# EAGLE design pe_09_version1_3 (EAGLE 9.5.1)
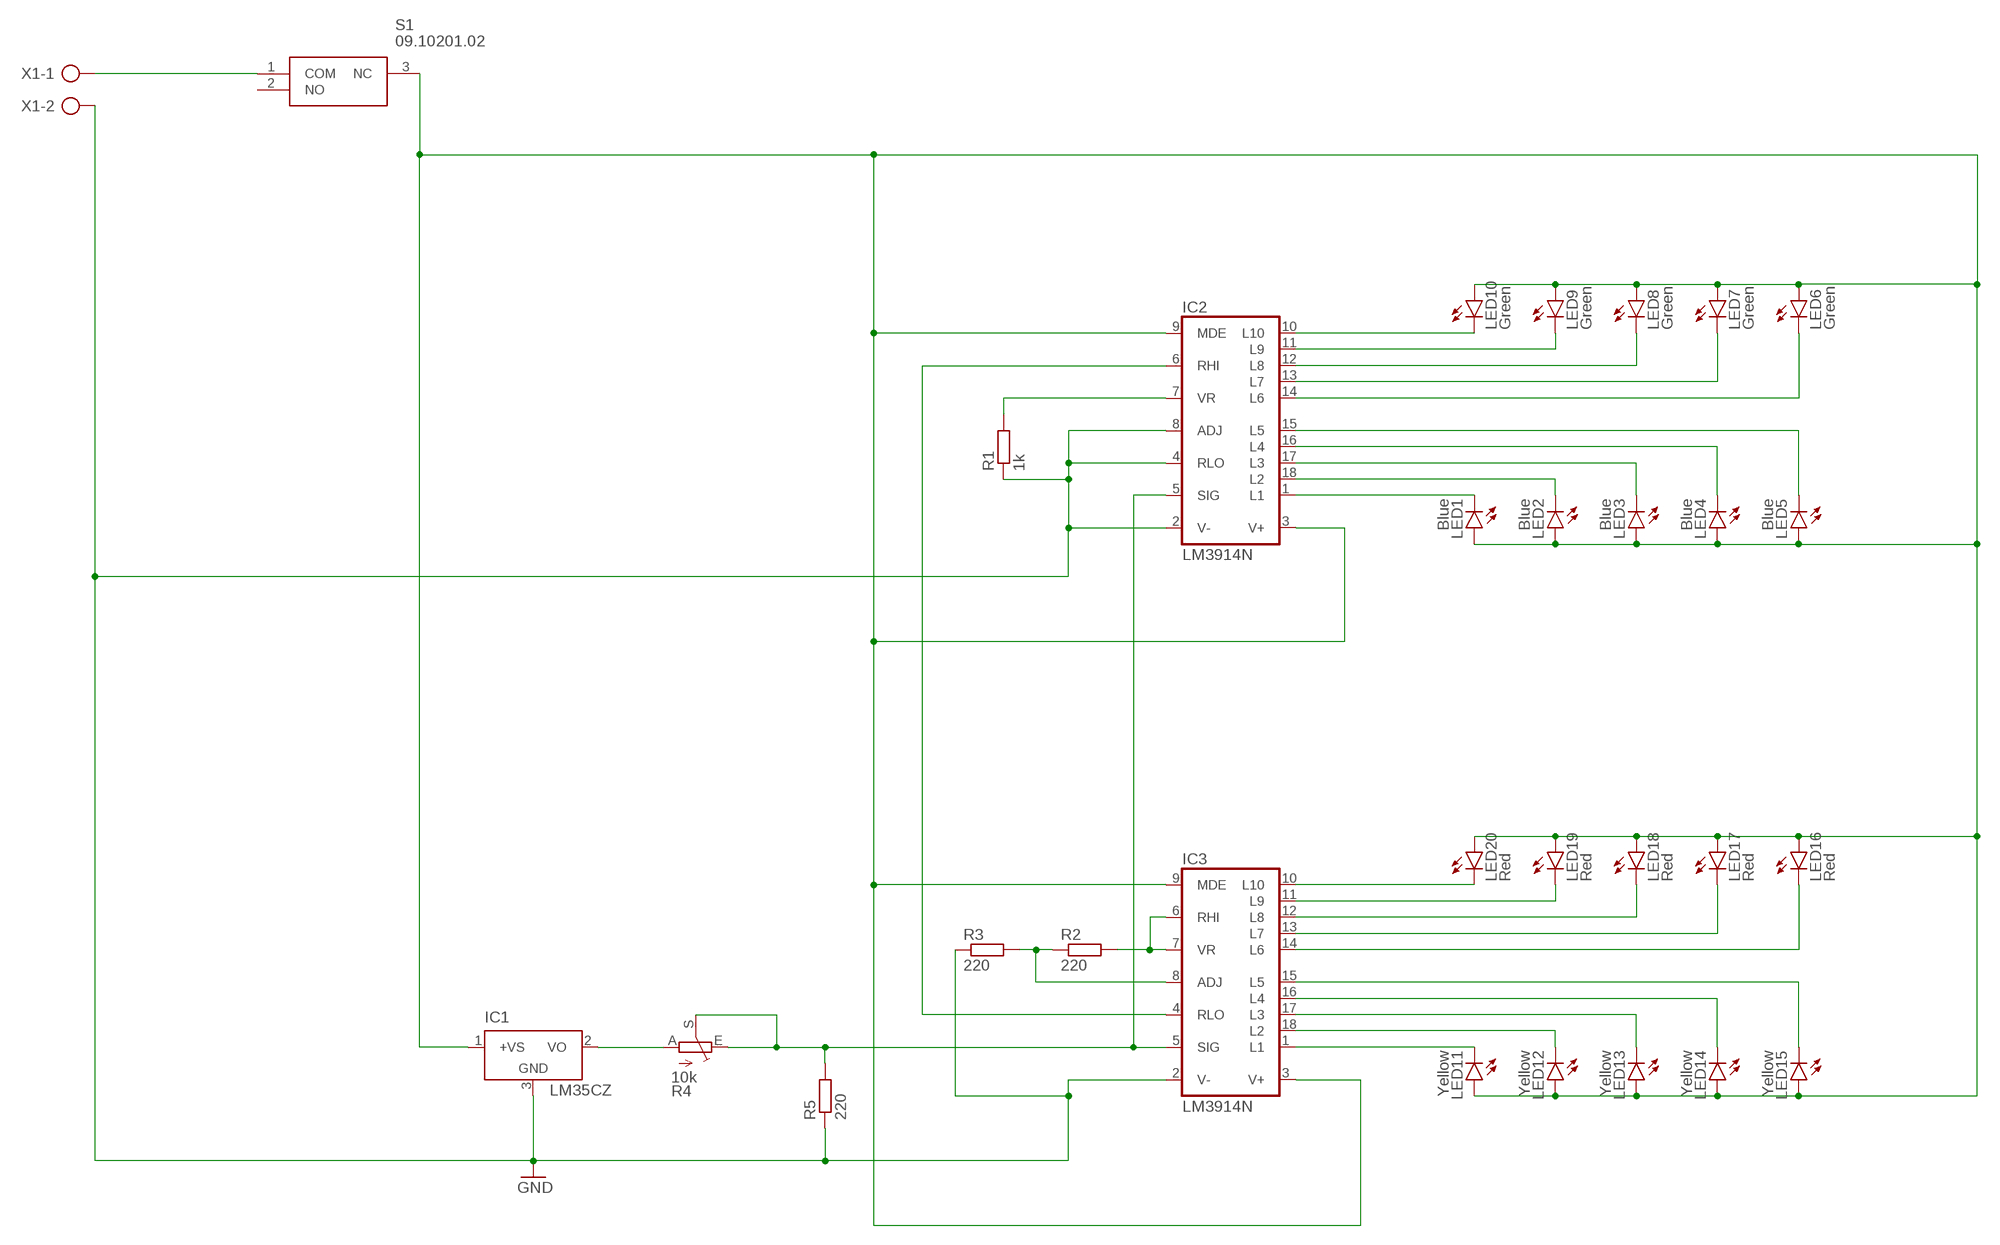
[diagram p0: schematic, sheet 1]

## Parts
IC1  LM35CZ  [TO92]
IC2  LM3914N  [DIL18]
IC3  LM3914N  [DIL18]
LED1  Blue  LED5MM  [LED5MM]
LED2  Blue  LED5MM  [LED5MM]
LED3  Blue  LED5MM  [LED5MM]
LED4  Blue  LED5MM  [LED5MM]
LED5  Blue  LED5MM  [LED5MM]
LED6  Green  LED5MM  [LED5MM]
LED7  Green  LED5MM  [LED5MM]
LED8  Green  LED5MM  [LED5MM]
LED9  Green  LED5MM  [LED5MM]
LED10  Green  LED5MM  [LED5MM]
LED11  Yellow  LED5MM  [LED5MM]
LED12  Yellow  LED5MM  [LED5MM]
LED13  Yellow  LED5MM  [LED5MM]
LED14  Yellow  LED5MM  [LED5MM]
LED15  Yellow  LED5MM  [LED5MM]
LED16  Red  LED5MM  [LED5MM]
LED17  Red  LED5MM  [LED5MM]
LED18  Red  LED5MM  [LED5MM]
LED19  Red  LED5MM  [LED5MM]
LED20  Red  LED5MM  [LED5MM]
R1  1k  R-EU_0207/10  [0207/10]
R2  220  R-EU_0207/10  [0207/10]
R3  220  R-EU_0207/10  [0207/10]
R4  10k  TRIM_EU-PT10  [PT-10]
R5  220  R-EU_0207/10  [0207/10]
S1  09.10201.02  [091020102]
X1  AK500/2  [AK500/2]

## Nets
GND: IC1.3(GND) IC2.2(V-) IC2.4(RLO) IC2.8(ADJ) IC3.2(V-) R1.1 R3.1 R5.1 X1.2
N$1: IC2.1(L1) LED1.K(C)
N$2: IC2.18(L2) LED2.K(C)
N$3: IC2.17(L3) LED3.K(C)
N$4: IC2.16(L4) LED4.K(C)
N$5: IC2.15(L5) LED5.K(C)
N$6: IC2.10(L10) LED10.K(C)
N$7: IC2.11(L9) LED9.K(C)
N$8: IC2.12(L8) LED8.K(C)
N$9: IC2.13(L7) LED7.K(C)
N$10: IC2.14(L6) LED6.K(C)
N$11: S1.1(COM) X1.1
N$12: IC2.7(VR) R1.2
N$13: IC3.1(L1) LED11.K(C)
N$14: IC3.18(L2) LED12.K(C)
N$15: IC3.17(L3) LED13.K(C)
N$16: IC3.16(L4) LED14.K(C)
N$17: IC3.15(L5) LED15.K(C)
N$18: IC3.10(L10) LED20.K(C)
N$19: IC3.11(L9) LED19.K(C)
N$20: IC3.12(L8) LED18.K(C)
N$21: IC3.13(L7) LED17.K(C)
N$22: IC3.14(L6) LED16.K(C)
N$23: IC2.6(RHI) IC3.4(RLO)
N$24: IC3.6(RHI) IC3.7(VR) R2.2
N$25: IC3.8(ADJ) R2.1 R3.2
N$26: IC1.2(VO) R4.A
N$27: IC2.5(SIG) IC3.5(SIG) R4.E R4.S R5.2
V+: IC1.1(+VS) IC2.3(V+) IC2.9(MDE) IC3.3(V+) IC3.9(MDE) LED1.A LED2.A LED3.A LED4.A LED5.A LED6.A LED7.A LED8.A LED9.A LED10.A LED11.A LED12.A LED13.A LED14.A LED15.A LED16.A LED17.A LED18.A LED19.A LED20.A S1.3(NC)
Unconnected: S1.2(NO)

## Library data of the parts
IC1 = lm35:LM35: Single-Supply Centigrade Temperature Sensor Vout = (10mV/°C x Temp °C) +5mmmV Source: http://www.national.com/ds/LM/LM35.pdf
IC2 IC3 = linear:LM3914N: LED DRIVER senses analog voltage levels and drives 10 LEDs
LED1-LED20 = led:LED: LED OSRAM: - CHIPLED LG R971, LG N971, LY N971, LG Q971, LY Q971, LO R971, LY R971 LH N974, LH R974 LS Q976, LO Q976, LY Q976 LO Q996 - Hyper CHIPLED LW Q18S LB Q993, LB Q99A, LB R99A - SideLED LS A670, LO A670, LY A670, LG A670, LP A670 LB A673, LV A673, LT A673, LW A673 LH A674 LY A675 LS A676, LA A676, LO A676, LY A676, LW A676 LS A679, LY A679, LG A679 - Hyper Micro SIDELED® LS Y876, LA Y876, LO Y876, LY Y876 LT Y87S - SmartLED LW L88C, LW L88S LB L89C, LB L89S, LG L890 LS L89K, LO L89K, LY L89K LS L896, LA L896, LO L896, LY L896 - TOPLED LS T670, LO T670, LY T670, LG T670, LP T670 LSG T670, LSP T670, LSY T670, LOP T670, LYG T670 LG T671, LOG T671, LSG T671 LB T673, LV T673, LT T673, LW T673 LH T674 LS T676, LA T676, LO T676, LY T676, LB T676, LH T676, LSB T676, LW T676 LB T67C, LV T67C, LT T67C, LS T67K, LO T67K, LY T67K, LW E67C LS E67B, LA E67B, LO E67B, LY E67B, LB E67C, LV E67C, LT E67C LW T67C LS T679, LY T679, LG T679 LS T770, LO T770, LY T770, LG T770, LP T770 LB T773, LV T773, LT T773, LW T773 LH T774 LS E675, LA E675, LY E675, LS T675 LS T776, LA T776, LO T776, LY T776, LB T776 LHGB T686 LT T68C, LB T68C - Hyper Mini TOPLED® LB M676 - Mini TOPLED Santana® LG M470 LS M47K, LO M47K, LY M47K Source: http://www.osram.convergy.de LUXEON: - LUMILED® LXK2-PW12-R00, LXK2-PW12-S00, LXK2-PW14-U00, LXK2-PW14-V00 LXK2-PM12-R00, LXK2-PM12-S00, LXK2-PM14-U00 LXK2-PE12-Q00, LXK2-PE12-R00, LXK2-PE12-S00, LXK2-PE14-T00, LXK2-PE14-U00 LXK2-PB12-K00, LXK2-PB12-L00, LXK2-PB12-M00, LXK2-PB14-N00, LXK2-PB14-P00, LXK2-PB14-Q00 LXK2-PR12-L00, LXK2-PR12-M00, LXK2-PR14-Q00, LXK2-PR14-R00 LXK2-PD12-Q00, LXK2-PD12-R00, LXK2-PD12-S00 LXK2-PH12-R00, LXK2-PH12-S00 LXK2-PL12-P00, LXK2-PL12-Q00, LXK2-PL12-R00 Source: www.luxeon.com KINGBRIGHT: KA-3528ASYC Source: www.kingbright.com
R1-R3 R5 = resistor:R-EU_: RESISTOR, European symbol
R4 = pot:TRIM_EU-: POTENTIOMETER
S1 = SamacSys_Parts:09.10201.02: Slide Switches 1K2 ACT GOLD RIGHT ANGL MNT RED Source: Datasheet <https://componentsearchengine.com/Datasheets/1/09.10201.02.pdf>; ALLIED_NUMBER: 70293429; ALLIED_PRICE-STOCK: https://www.alliedelec.com/eao-09-10201-02/70293429/; DESCRIPTION: Slide Switches 1K2 ACT GOLD RIGHT ANGL MNT RED; HEIGHT: 2.5mm; MANUFACTURER_NAME: EAO; MANUFACTURER_PART_NUMBER: 09.10201.02; MOUSER_PART_NUMBER: 123-09.10201.02; MOUSER_PRICE-STOCK: https://www.mouser.com/Search/Refine.aspx?Keyword=123-09.10201.02
X1 = con-ptr500:AK500/2: CONNECTOR; OC_FARNELL: unknown; OC_NEWARK: unknown

## Net classes
0 default: width 0.8 mm, clearance 0.205 mm

## Board
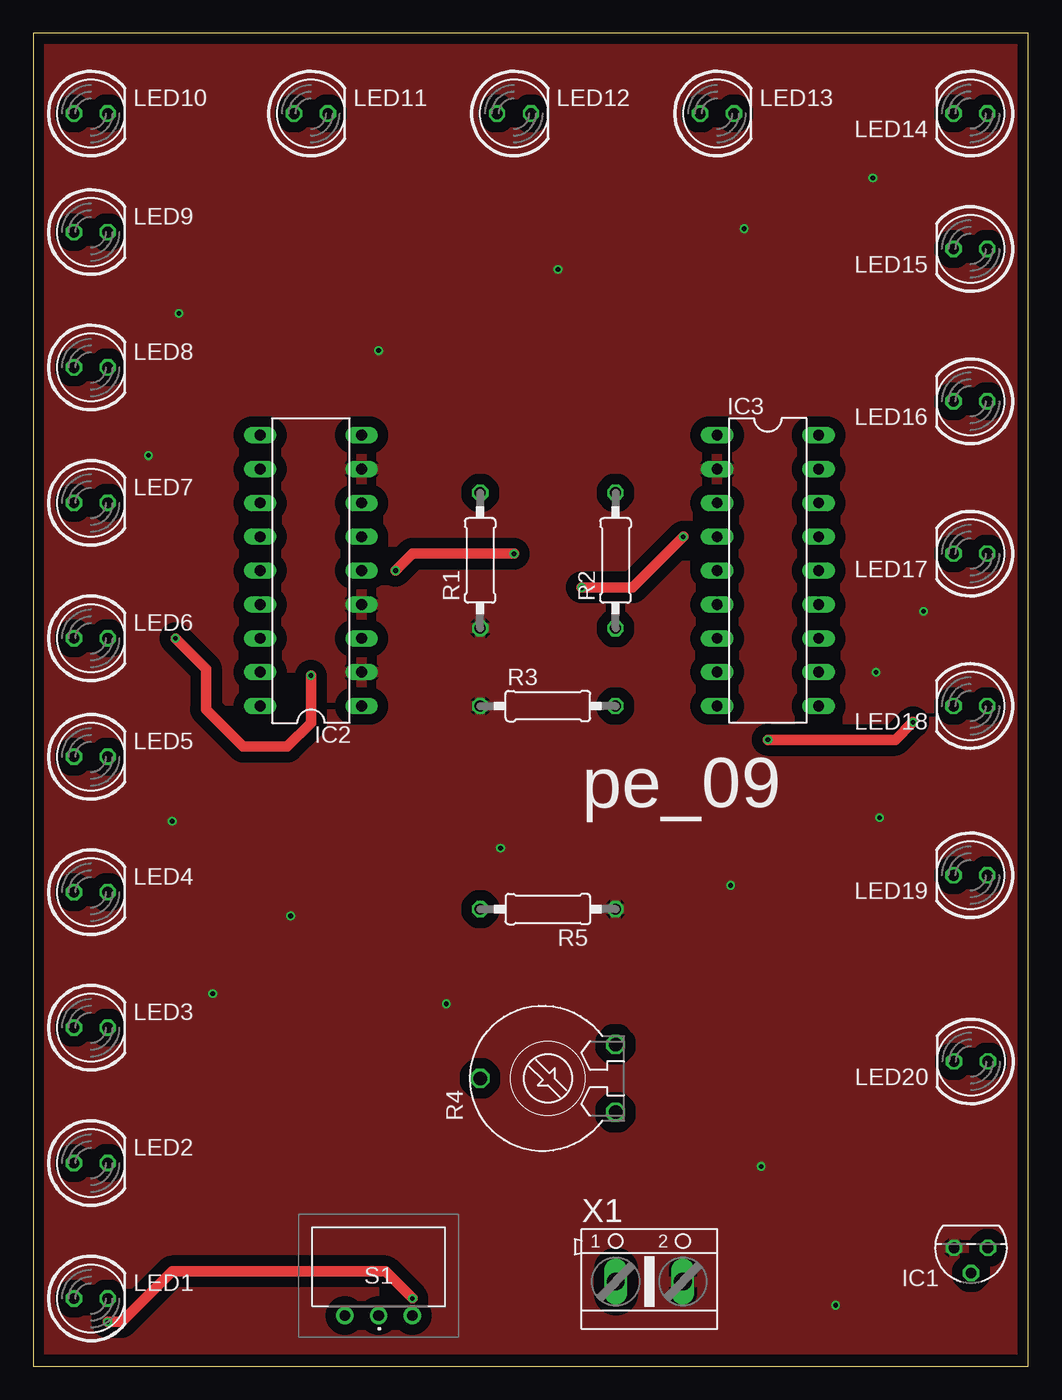
[diagram p1: board, top side]
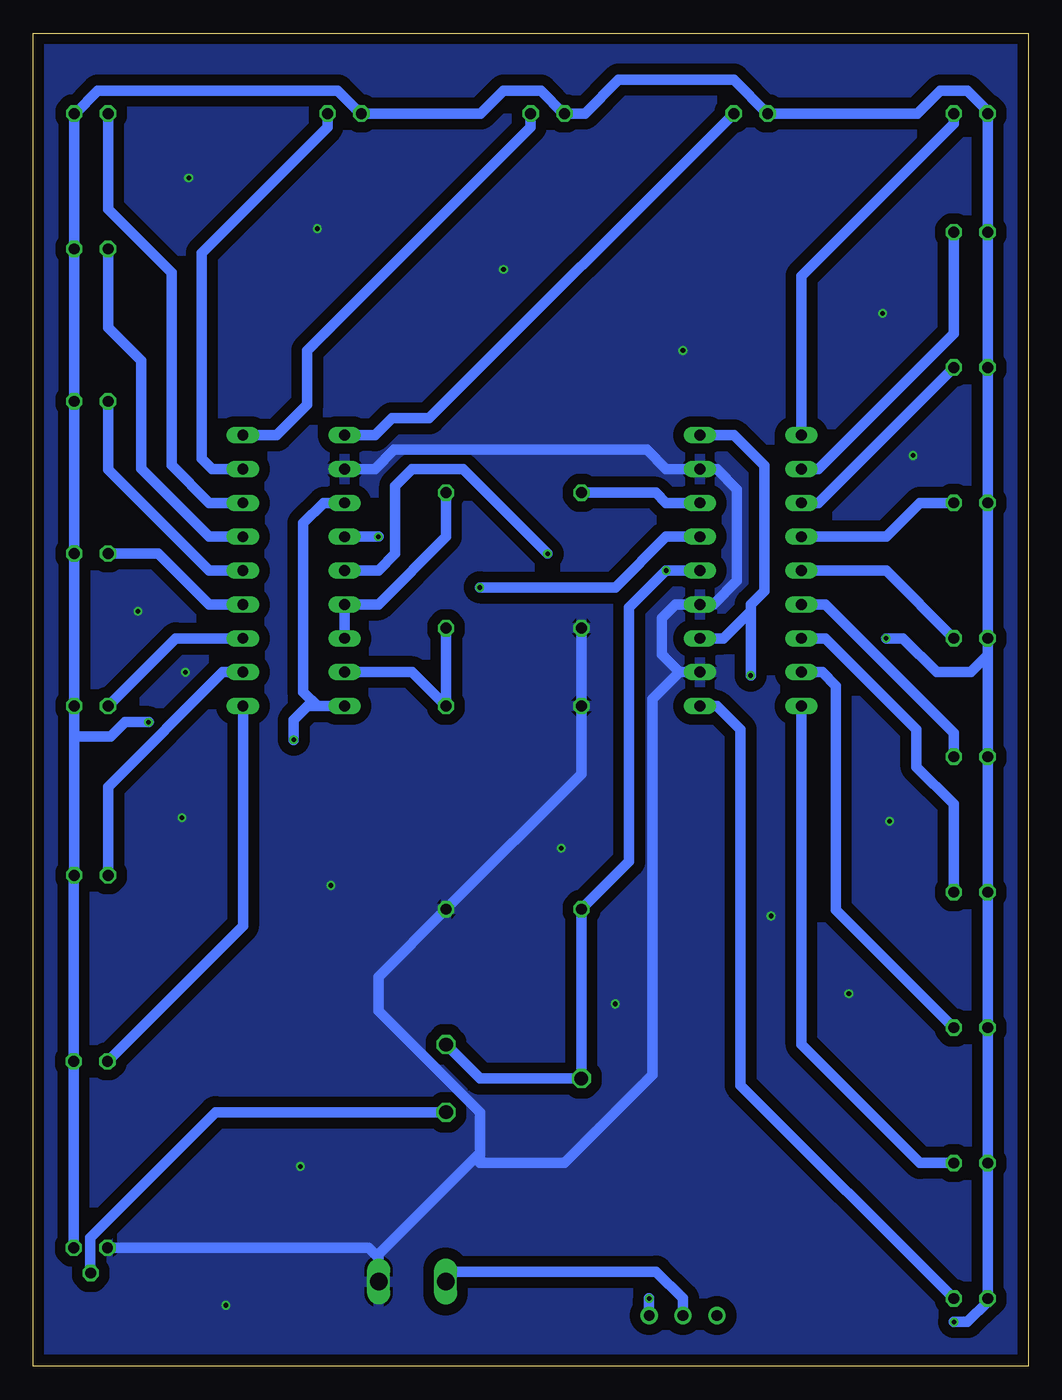
[diagram p2: board, bottom side, seen from below]

Size 74.66 x 100 mm. Coordinates in mm from the lower left corner, seen from the top.
Outline: 0,0 74.66,0 74.66,100 0,100 0,0
Copper layers (1*16): Top 0.035mm / dielectric 1.5mm / Bottom 0.035mm
Design rules "DesignRules": minimum track width 6mil, minimum drill 12mil, track to track 6mil, track to pad 6mil, pad to pad 6mil, via to via 6mil, smd to smd 6mil, copper to edge 20mil, drill to drill 8mil, minimum pad ring 8mil, minimum via ring 6mil, stop-mask expansion 3mil, vias tented up to drill 0mil, thermal gap 8mil

### Footprints (pad centres in the part's own frame; a part is rotated, then mirrored left to right if it is on the bottom)
TO92 = drill 0.813 octagon: 1 -1.27,0; 2 0,1.905; 3 1.27,0
DIL18 = drill 0.813 long: 1 -10.16,-3.81; 2 -7.62,-3.81; 3 -5.08,-3.81; 4 -2.54,-3.81; 5 0,-3.81; 6 2.54,-3.81; 7 5.08,-3.81; 8 7.62,-3.81; 9 10.16,-3.81; 10 10.16,3.81; 11 7.62,3.81; 12 5.08,3.81; 13 2.54,3.81; 14 0,3.81; 15 -2.54,3.81; 16 -5.08,3.81; 17 -7.62,3.81; 18 -10.16,3.81
LED5MM = drill 0.813 octagon: A -1.27,0; K 1.27,0
0207/10 = drill 0.813 octagon: 1 -5.08,0; 2 5.08,0
PT-10 = drill 1.016 octagon: A -2.54,-5.08; E 2.54,-5.08; S 0,5.08
091020102 = drill 0.8 pad 1.3: 1 0,0; 2 -2.54,0; 3 2.54,0
AK500/2 = drill 1.321 long: 1 -2.515,0; 2 2.515,0

### Placement (x,y rotation side)
IC1  70.36,8.89 180 top
IC2  20.83,59.69 90 top
IC3  55.12,59.69 270 top
LED1  4.32,5.08 0 top
LED2  4.32,15.24 0 top
LED3  4.32,25.4 0 top
LED4  4.32,35.56 0 top
LED5  4.32,45.72 0 top
LED6  4.32,54.61 0 top
LED7  4.32,64.77 0 top
LED8  4.32,74.93 0 top
LED9  4.32,85.09 0 top
LED10  4.32,93.98 0 top
LED11  20.83,93.98 0 top
LED12  36.07,93.98 0 top
LED13  51.31,93.98 0 top
LED14  70.32,93.98 180 top
LED15  70.32,83.82 180 top
LED16  70.32,72.39 180 top
LED17  70.32,60.96 180 top
LED18  70.32,49.53 180 top
LED19  70.32,36.83 180 top
LED20  70.36,22.86 180 top
R1  33.53,60.45 90 top
R2  43.69,60.45 90 top
R3  38.61,49.53 0 top
R4  38.61,21.59 90 top
R5  38.61,34.29 180 top
S1  25.91,3.81 0 top
X1  46.23,6.35 0 top

### Tracks (layer width: path | path; a pad name or v marks a point on that pad's centre or on a via)
GND  (via drill 0.35)
  Bottom 0.8: IC1.3 49.5,8.89 48.74,8.13 X1.2 48.74,8.41 41.15,16 | 26.16,52.07 28.19,50.04 28.19,21.84 34.8,15.24 41.15,15.24 41.15,16 | IC2.2 26.16,52.07 | 41.15,16 41.15,19.05 48.77,26.67 48.77,29.21 R5.1 33.53,44.45 R3.1 R1.1 | IC3.2 49.02,67.31 47.58,68.75 28.62,68.75 27.18,67.31 IC2.8 23.37,67.31 21.84,65.79 21.84,58.93 23.62,57.15 IC2.4 26.46,57.15 27.48,56.13 27.48,53.39 26.16,52.07
  other vias: 25.91,76.2 39.37,82.3 53.34,85.34 62.99,89.15 10.92,78.99 8.64,68.33 60.2,4.57 54.61,14.99 52.32,36.07 63.5,41.15 35.05,38.86 63.25,52.07 66.8,56.64 30.99,27.18 19.3,33.78 13.46,27.94 10.41,40.89
  pour Top (isolate 0.8): -0.25,99.06 -0.25,1.27 74.17,1.27 74.17,99.06
  pour Bottom (isolate 0.8): -0.76,99.06 -0.76,1.27 74.17,1.27 74.17,99.06
N$1
  Bottom 0.8: LED1.K 21.59,21.08 21.59,47.75 23.37,49.53 IC2.1
N$2
  Bottom 0.8: LED2.K 8.13,15.24 17.02,24.13 IC2.18
N$3
  Bottom 0.8: IC2.17 15.45,52.07 14.43,51.05 14.43,34.24 LED3.K
N$4
  Bottom 0.8: IC2.16 15.24,54.61 8.38,47.75 8.38,44.96 5.59,42.16 LED4.K
N$5
  Bottom 0.8: IC2.15 15.24,57.15 5.59,47.5 LED5.K
N$6
  Bottom 0.8: LED10.K 5.59,93.22 17.02,81.79 IC2.10
N$7
  Bottom 0.8: IC2.11 15.75,67.31 5.59,77.47 LED9.K
N$8
  Bottom 0.8: LED8.K 15.75,64.77 IC2.12
N$9
  Bottom 0.8: LED7.K 8.13,64.77 10.67,62.23 IC2.13
N$10
  Bottom 0.8: LED6.K 10.67,59.69 IC2.14
N$11
  Bottom 0.8: S1.1 25.91,5.08 27.93,7.1 42.97,7.1 X1.1
N$12
  Bottom 0.8: IC2.7 27.18,64.77 27.94,65.53 R1.2
N$13
  Bottom 0.8: LED11.K 44.96,71.12 47.75,71.12 49.02,69.85 IC3.1
N$14
  Bottom 0.8: LED12.K 37.34,92.96 54.1,76.2 54.1,72.14 56.39,69.85 IC3.18
N$15
  Bottom 0.8: IC3.17 61.25,67.31 62.02,68.08 62.02,83.52 52.58,92.96 LED13.K
N$16
  Bottom 0.8: IC3.16 61.47,64.77 64.29,67.59 64.29,82.05 69.05,86.81 LED14.K
N$17
  Bottom 0.8: IC3.15 61.47,62.23 66.56,67.33 66.56,75.43 69.05,77.92 LED15.K
N$18
  Bottom 0.8: IC3.10 58.93,33.02 LED20.K
N$19
  Bottom 0.8: IC3.11 60.45,52.07 69.05,43.47 LED19.K
N$20
  Bottom 0.8: LED18.K 63.97,54.61 IC3.12
N$21
  Bottom 0.8: IC3.13 61.47,57.15 65.28,60.96 LED17.K
N$22
  Bottom 0.8: IC3.14 61.47,59.69 69.05,67.27 LED16.K
N$23  (via drill 0.35)
  Top 0.8: v48.77,62.23 44.96,58.42 v41.15,58.42
  Bottom 0.8: IC2.6 27.18,62.23 30.99,58.42 v41.15,58.42 | IC3.4 v48.77,62.23
N$24
  Bottom 0.8: IC3.7 IC3.6 48.77,57.15 43.69,62.23 R2.2
N$25
  Bottom 0.8: R2.1 R3.2 46.23,52.07 IC3.8
N$26
  Bottom 0.8: IC1.2 70.38,7.01 70.38,9.65 60.98,19.05 R4.A
N$27  (via drill 0.35)
  Top 0.8: v27.18,59.69 28.45,60.96 v36.07,60.96
  Bottom 0.8: R4.E 41.15,21.59 R4.S R5.2 29.96,37.86 29.96,56.91 v27.18,59.69 IC2.5 | IC3.5 48.77,59.69 47.5,60.96 47.5,66.04 46.23,67.31 42.42,67.31 v36.07,60.96
V+  (via drill 0.35)
  Top 0.8: v55.12,46.99 64.68,46.99 v66.01,48.31 | v28.45,5.08 26.42,7.11 10.41,7.11 6.62,3.32 v5.57,3.32 | v10.67,54.61 12.95,52.32 12.95,49.28 15.75,46.48 19.05,46.48 20.83,48.26 v20.83,51.82
  Bottom 0.8: LED6.A LED5.A LED4.A LED3.A LED2.A LED1.A 3.05,4.83 4.56,3.32 v5.57,3.32 | LED6.A LED7.A LED8.A LED9.A LED10.A 3.05,94.17 4.58,95.7 6.6,95.7 8.32,93.98 LED11.A 22.1,96.52 30.73,96.52 33.27,93.98 LED12.A 34.86,93.98 36.58,95.7 39.36,95.7 41.09,93.98 LED13.A 50.1,93.98 51.82,95.7 69.81,95.7 71.53,93.98 LED14.A LED15.A LED16.A LED17.A LED18.A 71.59,47.24 | LED6.A 3.05,53.34 4.32,52.07 6.86,52.07 9.4,54.61 v10.67,54.61 | IC1.1 LED20.A 71.63,36.79 LED19.A 71.59,47.24 | IC3.9 53.34,49.53 | 53.34,49.53 54.06,49.53 55.12,48.47 v55.12,46.99 | IC3.3 52.87,64.77 54.4,63.24 54.4,50.59 53.34,49.53 | IC2.3 22.86,54.61 20.83,56.64 | IC2.9 22.1,69.85 19.81,67.56 19.81,58.17 20.83,57.15 20.83,56.64 | S1.3 v28.45,5.08 | v20.83,51.82 20.83,56.64 | v66.01,48.31 67.76,48.31 68.83,47.24 71.59,47.24

### Text on the board
tNames: pe_09